# EAGLE design mdv2 (EAGLE 8.2.2)
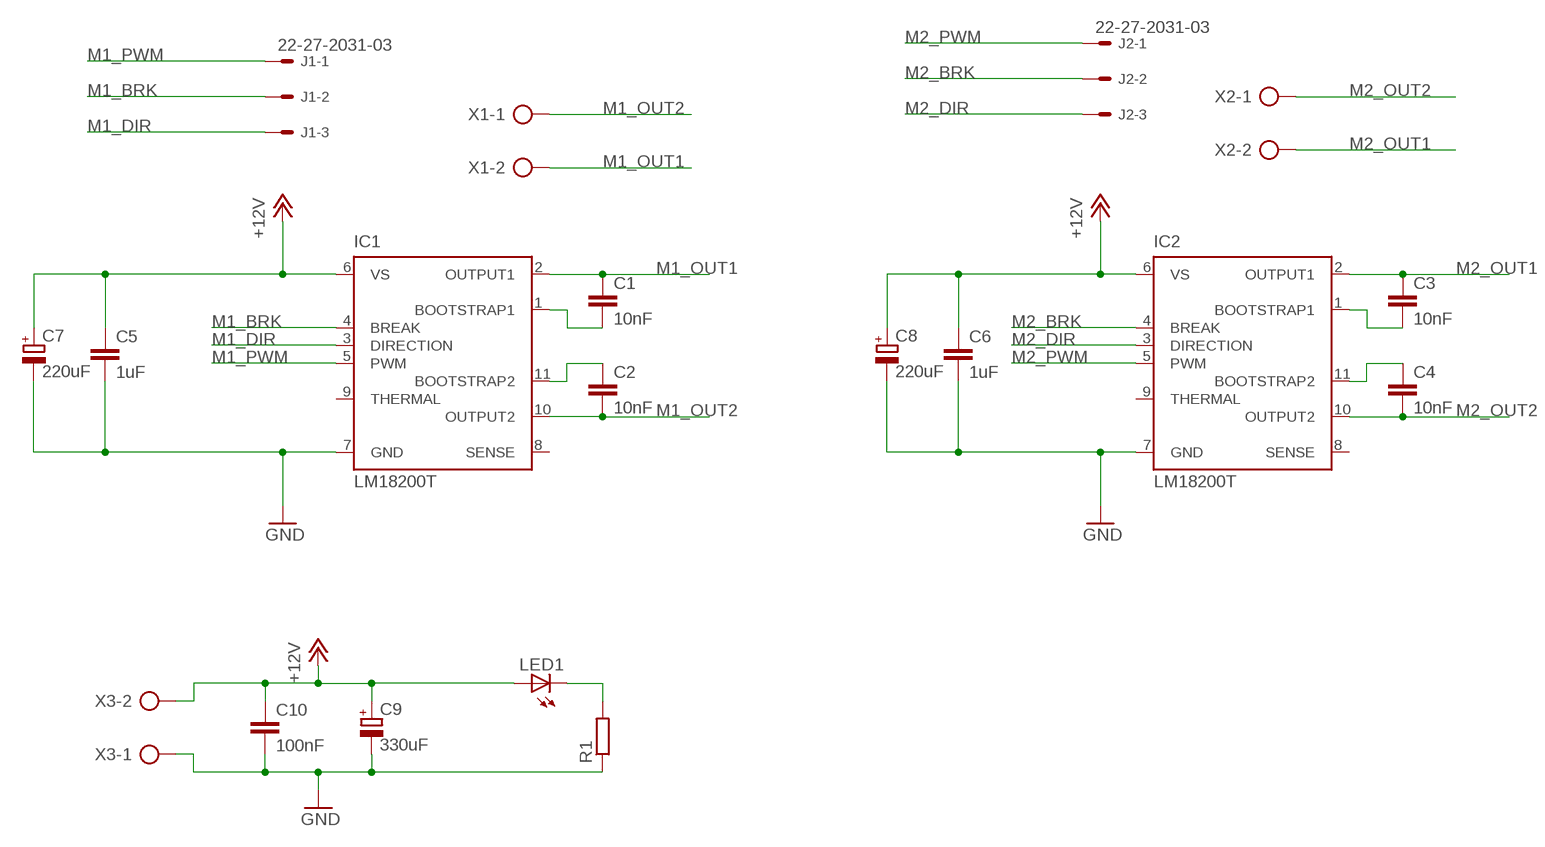
[diagram p0: schematic, sheet 1]

## Parts
C1  10nF  C-EU050-025X075  [C050-025X075]
C2  10nF  C-EU050-025X075  [C050-025X075]
C3  10nF  C-EU050-025X075  [C050-025X075]
C4  10nF  C-EU050-025X075  [C050-025X075]
C5  1uF  C-EU050-045X075  [C050-045X075]
C6  1uF  C-EU050-045X075  [C050-045X075]
C7  220uF  CPOL-EUE3.5-8  [E3,5-8]
C8  220uF  CPOL-EUE3.5-8  [E3,5-8]
C9  330uF  CPOL-EUE3.5-8  [E3,5-8]
C10  100nF  C-EU050-025X075  [C050-025X075]
IC1  LM18200T  [TO-220-11]
IC2  LM18200T  [TO-220-11]
J1  22-27-2031-03  [6410-03]
J2  22-27-2031-03  [6410-03]
LED1  LED5MM  [LED5MM]
R1  R-EU_0207/7  [0207/7]
X1  AK300/2  [AK300/2]
X2  AK300/2  [AK300/2]
X3  AK300/2  [AK300/2]

## Nets
+12V: C5.1 C6.1 C7.+ C8.+ C9.+ C10.1 IC1.6(VS) IC2.6(VS) LED1.A X3.2
GND: C5.2 C6.2 C7.- C8.- C9.- C10.2 IC1.7(GND) IC2.7(GND) R1.1 X3.1
M1_BRK: IC1.4(BREAK) J1.2
M1_DIR: IC1.3(DIRECTION) J1.3
M1_OUT1: C1.1 IC1.2(OUTPUT1) X1.2
M1_OUT2: C2.2 IC1.10(OUTPUT2) X1.1
M1_PWM: IC1.5(PWM) J1.1
M2_BRK: IC2.4(BREAK) J2.2
M2_DIR: IC2.3(DIRECTION) J2.3
M2_OUT1: C3.1 IC2.2(OUTPUT1) X2.2
M2_OUT2: C4.2 IC2.10(OUTPUT2) X2.1
M2_PWM: IC2.5(PWM) J2.1
N$1: LED1.K(C) R1.2
N$2: C1.2 IC1.1(BOOTSTRAP1)
N$3: C2.1 IC1.11(BOOTSTRAP2)
N$10: C3.2 IC2.1(BOOTSTRAP1)
N$11: C4.1 IC2.11(BOOTSTRAP2)
Unconnected: IC1.8(SENSE) IC1.9(THERMAL) IC2.8(SENSE) IC2.9(THERMAL)

## Library data of the parts
C1-C6 C10 = rcl:C-EU: CAPACITOR, European symbol
C7-C9 = rcl:CPOL-EU: POLARIZED CAPACITOR, European symbol
IC1 IC2 = national-semiconductor:LM18200T: 3A, 55V H-Bridge Motor Control SourcE: http://cache.national.com/ds/LM/LMD18200.pdf; OC_FARNELL: unknown; OC_NEWARK: unknown
J1 J2 = con-molex:22-?-03: CONNECTOR wire to board 2.54 mm (.1 inch) pitch header; OC_FARNELL: unknown; OC_NEWARK: unknown
LED1 = adafruit:LED: LED OSRAM: - CHIPLED LG R971, LG N971, LY N971, LG Q971, LY Q971, LO R971, LY R971 LH N974, LH R974 LS Q976, LO Q976, LY Q976 LO Q996 - Hyper CHIPLED LW Q18S LB Q993, LB Q99A, LB R99A - SideLED LS A670, LO A670, LY A670, LG A670, LP A670 LB A673, LV A673, LT A673, LW A673 LH A674 LY A675 LS A676, LA A676, LO A676, LY A676, LW A676 LS A679, LY A679, LG A679 - Hyper Micro SIDELED® LS Y876, LA Y876, LO Y876, LY Y876 LT Y87S - SmartLED LW L88C, LW L88S LB L89C, LB L89S, LG L890 LS L89K, LO L89K, LY L89K LS L896, LA L896, LO L896, LY L896 - TOPLED LS T670, LO T670, LY T670, LG T670, LP T670 LSG T670, LSP T670, LSY T670, LOP T670, LYG T670 LG T671, LOG T671, LSG T671 LB T673, LV T673, LT T673, LW T673 LH T674 LS T676, LA T676, LO T676, LY T676, LB T676, LH T676, LSB T676, LW T676 LB T67C, LV T67C, LT T67C, LS T67K, LO T67K, LY T67K, LW E67C LS E67B, LA E67B, LO E67B, LY E67B, LB E67C, LV E67C, LT E67C LW T67C LS T679, LY T679, LG T679 LS T770, LO T770, LY T770, LG T770, LP T770 LB T773, LV T773, LT T773, LW T773 LH T774 LS E675, LA E675, LY E675, LS T675 LS T776, LA T776, LO T776, LY T776, LB T776 LHGB T686 LT T68C, LB T68C - Hyper Mini TOPLED® LB M676 - Mini TOPLED Santana® LG M470 LS M47K, LO M47K, LY M47K Source: http://www.osram.convergy.de/
R1 = rcl:R-EU_: RESISTOR, European symbol
X1-X3 = con-ptr500:AK300/2: CONNECTOR; OC_FARNELL: unknown; OC_NEWARK: unknown

## Board
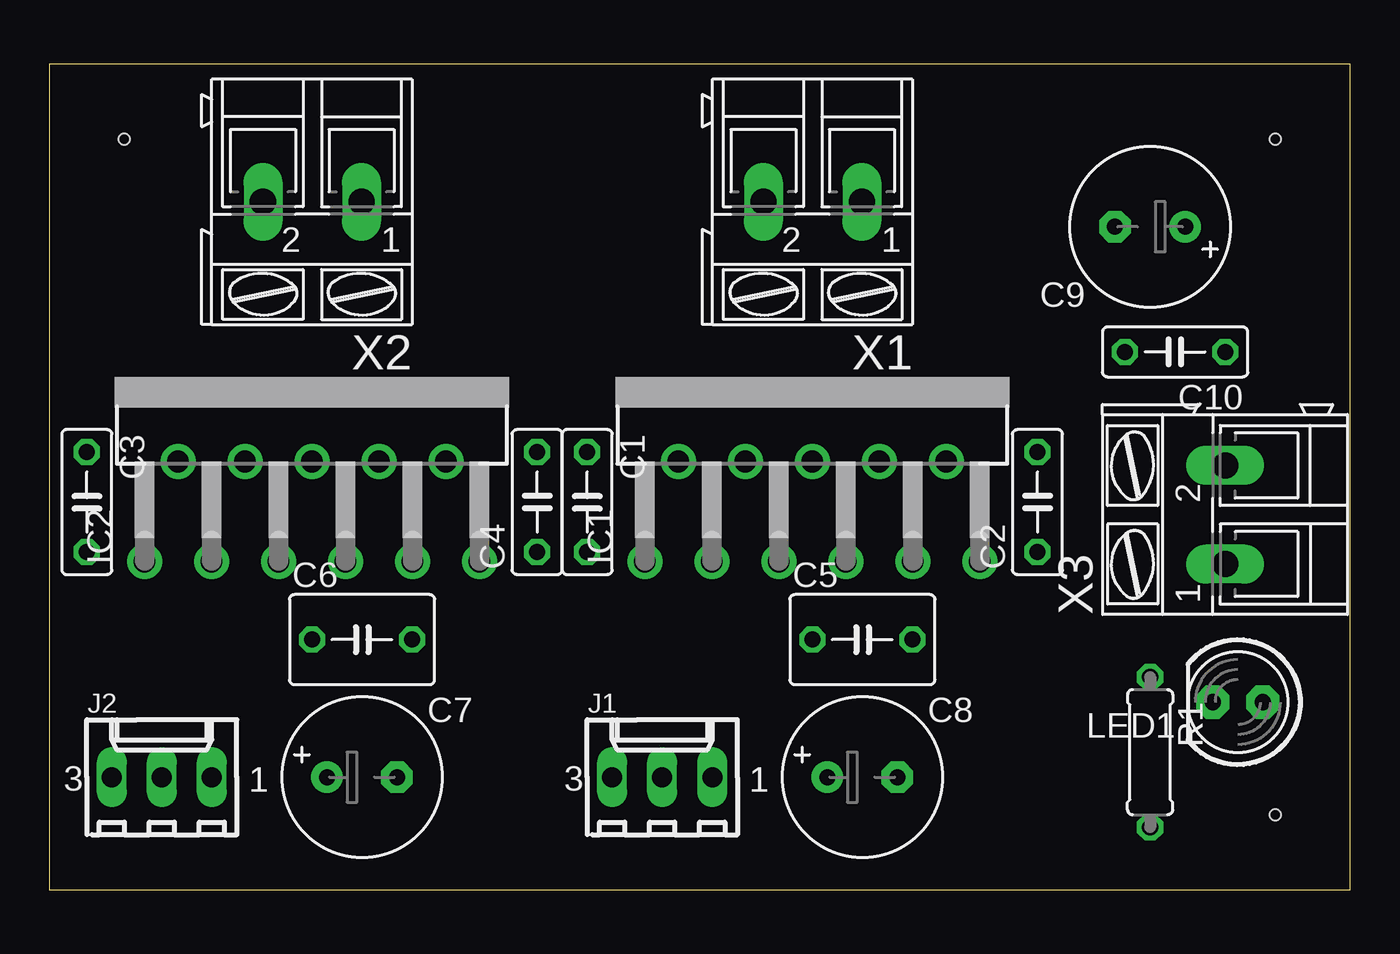
[diagram p1: board, top side]
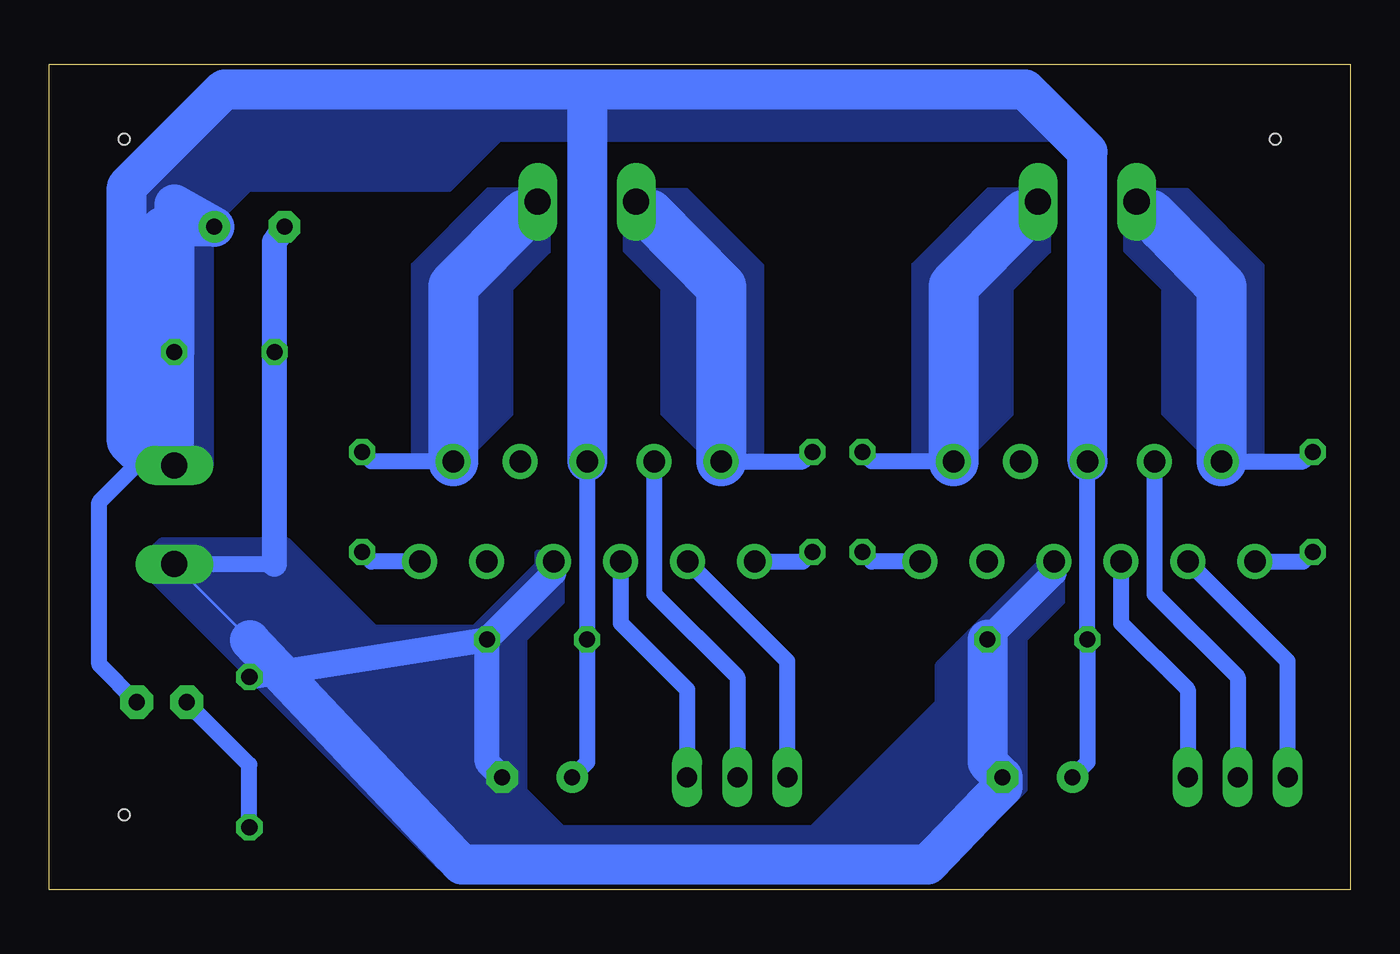
[diagram p2: board, bottom side, seen from below]

Size 66.04 x 41.91 mm. Coordinates in mm from the lower left corner, seen from the top.
Outline: 0,0 66.04,0 66.04,41.91 0,41.9 0,0
Copper layers (1*16): Top 0.035mm / dielectric 1.5mm / Bottom 0.035mm
Design rules "default": minimum track width 6mil, minimum drill 0.35mm, track to track 6mil, track to pad 6mil, pad to pad 6mil, via to via 6mil, smd to smd 6mil, copper to edge 40mil, drill to drill 6mil, minimum pad ring 10mil, minimum via ring 8mil, stop-mask expansion 4mil, vias tented up to drill 0mil, thermal gap 10mil
Holes 0.55 mm at 3.81,38.1 62.23,3.81 62.23,38.1

### Footprints (pad centres in the part's own frame; a part is rotated, then mirrored left to right if it is on the bottom)
C050-025X075 = drill 0.813 octagon: 1 -2.54,0; 2 2.54,0
C050-045X075 = drill 0.813 octagon: 1 -2.54,0; 2 2.54,0
E3,5-8 = drill 0.813 pad 1.6: + -1.778,0 | drill 0.813 pad 1.6 octagon: - 1.778,0
TO-220-11 = drill 1.1 pad 1.778: 1 -8.5,-9.37; 2 -6.8,-4.29; 3 -5.1,-9.37; 4 -3.4,-4.29; 5 -1.7,-9.37; 6 0,-4.29; 7 1.7,-9.37; 8 3.4,-4.29; 9 5.1,-9.37; 10 6.8,-4.29; 11 8.5,-9.37
6410-03 = drill 1.016 long: 1 2.54,0; 2 0,0; 3 -2.54,0
LED5MM = drill 0.813 pad 1.676 octagon: A -1.27,0; K 1.27,0
0207/7 = drill 0.813 octagon: 1 -3.81,0; 2 3.81,0
AK300/2 = drill 1.321 long: 1 -2.515,0; 2 2.489,0

### Placement (x,y rotation side)
C1  27.3,19.68 270 top
C2  50.16,19.68 90 top
C3  1.91,19.68 270 top
C4  24.77,19.68 90 top
C5  41.27,12.7 0 top
C6  15.88,12.7 0 top
C7  15.88,5.71 0 top
C8  41.27,5.71 0 top
C9  55.88,33.66 180 top
C10  57.15,27.3 180 top
IC1  38.73,26.04 0 top
IC2  13.34,26.04 0 top
J1  31.11,5.71 0 top
J2  5.71,5.71 0 top
LED1  60.33,9.53 180 top
R1  55.88,6.99 270 top
X1  38.73,34.92 180 top
X2  13.34,34.92 180 top
X3  59.69,19.05 90 top

### Tracks (layer width: path | path; a pad name or v marks a point on that pad's centre or on a via)
+12V
  Bottom 0.813: IC2.6 C6.1 13.34,6.48 C7.+ | IC1.6 C5.1 38.73,6.48 C8.+ | LED1.A 63.5,11.43 63.5,19.68 61.65,21.54 X3.2
  Bottom 2.032: IC2.6 13.34,37.47 16.51,40.64 38.73,40.64 | 38.73,40.64 IC1.6 | X3.2 C10.1 59.69,34.8 C9.+ 60.33,33.66 61.59,22.23 62.1,22.73 62.1,35.69 57.15,40.64 38.73,40.64
  pour Bottom (no thermals): 12.7,38.1 16.51,41.91 55.88,41.91 61.59,36.2 61.59,21.59 60.96,20.95 58.42,20.95 57.78,21.59 57.78,33.66 55.88,35.56 45.72,35.56 43.18,38.1
GND
  Bottom 0.152: R1.1 55.85,12.7 | 55.85,12.7 X3.1 | 55.85,12.68 55.85,12.7
  Bottom 0.813: X3.1 54.61,16.54
  Bottom 1.27: IC2.7 15.04,16.08 C6.2 | C5.2 43.81,6.48 C8.- | IC1.7 40.44,16.08 C5.2 | C9.- 54.61,32.89 C10.2 54.61,16.54 | R1.1 C5.2
  Bottom 2.032: C6.2 18.41,6.48 C7.- 17.65,5.21 18.41,4.45 21.46,1.27 45.09,1.27 55.85,12.68
  pour Bottom (no thermals): 14.61,17.14 14.61,14.61 16.51,12.7 16.51,5.08 21.59,0 45.09,0 57.15,12.06 60.96,15.88 60.96,17.14 60.33,17.78 58.42,17.78 53.98,17.78 49.53,13.34 44.45,13.34 41.27,16.51 41.27,17.14 40.01,17.14 40.01,14.61 41.91,12.7 41.91,5.08 40.01,3.17 27.3,3.17 20.95,9.53 20.95,11.43 15.24,17.14
M1_BRK
  Bottom 0.813: IC1.4 35.34,15.02 31.11,10.79 J1.2
M1_DIR
  Bottom 0.813: J1.3 28.57,11.61 IC1.3
M1_OUT1
  Bottom 0.813: IC1.2 27.79,21.75 C1.1
  Bottom 1.27: 35.56,34.29 X1.2
  Bottom 2.54: IC1.2 31.93,30.61 35.56,34.29
  pour Bottom (no thermals): 36.2,35.56 33.66,35.56 29.84,31.75 29.84,21.59 32.38,21.59 34.92,24.13 34.92,30.48 36.83,32.38 36.83,34.92
M1_OUT2
  Bottom 0.813: IC1.10 49.69,21.75 C2.2
  Bottom 1.27: 41.91,34.29 X1.1
  Bottom 2.54: IC1.10 45.53,30.64 41.91,34.29
  pour Bottom (no thermals): 41.27,35.56 43.81,35.56 47.62,31.75 47.62,21.59 45.09,21.59 42.55,24.13 42.55,30.48 40.64,32.38 40.64,34.92
M1_PWM
  Bottom 0.813: IC1.5 37.03,13.54 33.66,10.16 J1.1
M2_BRK
  Bottom 0.813: IC2.4 9.94,15.02 5.71,10.79 J2.2
M2_DIR
  Bottom 0.813: J2.3 3.17,11.61 IC2.3
M2_OUT1
  Bottom 0.813: IC2.2 2.38,21.75 C3.1
  Bottom 1.27: 10.16,34.29 X2.2
  Bottom 2.54: IC2.2 6.54,30.61 9.53,33.66 10.16,34.29
  pour Bottom (no thermals): 10.16,35.56 8.26,35.56 4.45,31.75 4.45,21.59 6.99,21.59 9.53,24.13 9.53,30.48 11.43,32.38 11.43,34.29
M2_OUT2
  Bottom 0.813: IC2.10 24.29,21.75 C4.2
  Bottom 1.27: 16.51,34.29 X2.1
  Bottom 2.54: IC2.10 20.14,30.64 16.51,34.29
  pour Bottom (no thermals): 15.88,35.56 18.41,35.56 22.23,31.75 22.23,21.59 19.68,21.59 17.14,24.13 17.14,30.48 15.24,32.38 15.24,34.92
M2_PWM
  Bottom 0.813: IC2.5 11.63,13.54 8.26,10.16 J2.1
N$1
  Bottom 0.813: R1.2 55.88,6.35 LED1.K
N$2
  Bottom 0.813: IC1.1 27.79,16.66 C1.2
N$3
  Bottom 0.813: IC1.11 49.69,16.66 C2.1
N$10
  Bottom 0.813: IC2.1 2.38,16.66 C3.2
N$11
  Bottom 0.813: IC2.11 24.29,16.66 C4.1